# EAGLE schematic HeadphoneSlice (EAGLE 7.5.0)
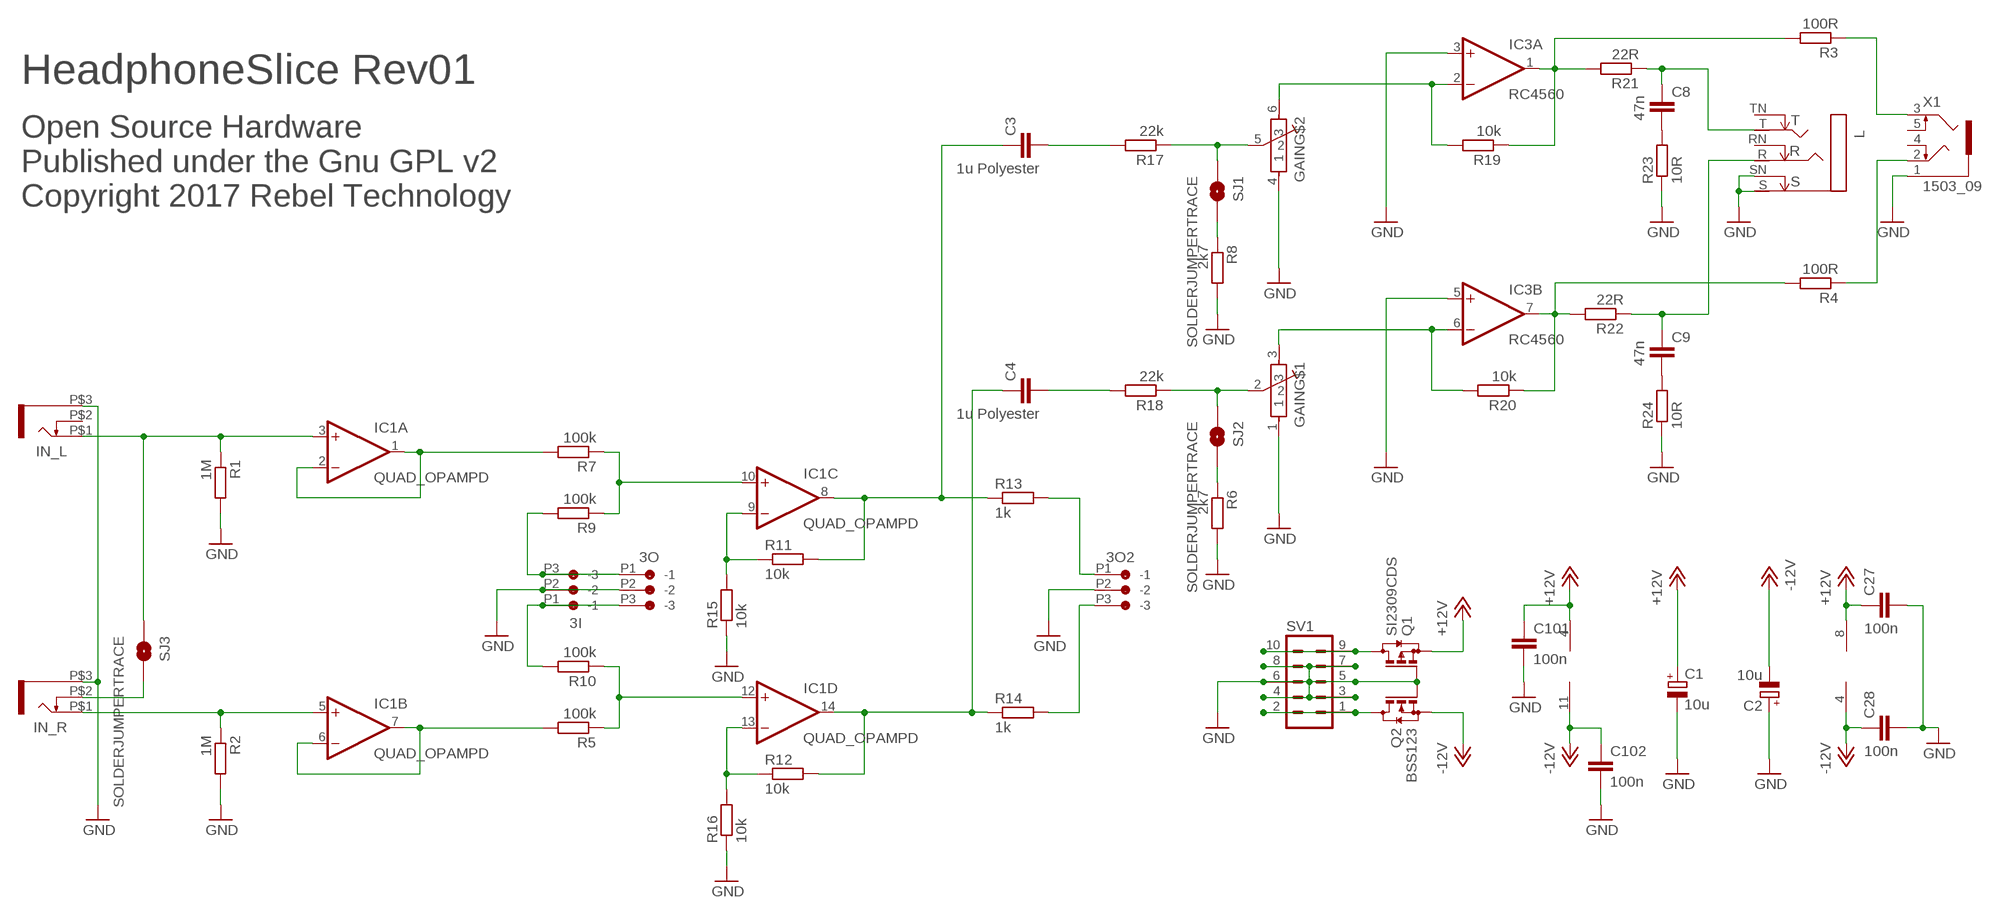
[diagram p0: schematic, sheet 1]

## Parts
3I  CON-JST_PH_3W  [CON-JST_PH_3W]
3O  CON-JST_PH_3W  [CON-JST_PH_3W]
3O2  CON-JST_PH_3W  [CON-JST_PH_3W]
C1  10u  CPOL-EU153CLV-0505  [153CLV-0505]
C2  10u  CPOL-EU153CLV-0505  [153CLV-0505]
C3  1u Polyester  C-EUC1210  [C1210]
C4  1u Polyester  C-EUC1210  [C1210]
C8  47n  C-EUC0603  [C0603]
C9  47n  C-EUC0603  [C0603]
C27  100n  C-EUC0603  [C0603]
C28  100n  C-EUC0603  [C0603]
C101  100n  C-EUC0603  [C0603]
C102  100n  C-EUC0603  [C0603]
GAIN  POT-BOURNS-PTD902  [POT-BOURNS-PTD902]
IC1  QUAD_OPAMPD  [SO14]
IC3  RC4560  NE5532D  [SO08]
IN_L  JACK-UJ-3502-RSLOT  [UJ-3502-R-SLOT]
IN_R  JACK-UJ-3502-RSLOT  [UJ-3502-R-SLOT]
L  NEUTRIK_NMJ6HCD2  [NMJ6HCD2]
Q1  SI2309CDS  BSS84  [SOT23]
Q2  BSS123  [SOT23]
R1  1M  R-EU_0603  [0603]
R2  1M  R-EU_0603  [0603]
R3  100R  R-EU_0603  [0603]
R4  100R  R-EU_0603  [0603]
R5  100k  R-EU_0603  [0603]
R6  2k7  R-EU_0603  [0603]
R7  100k  R-EU_0603  [0603]
R8  2k7  R-EU_0603  [0603]
R9  100k  R-EU_0603  [0603]
R10  100k  R-EU_0603  [0603]
R11  10k  R-EU_0603  [0603]
R12  10k  R-EU_0603  [0603]
R13  1k  R-EU_0603  [0603]
R14  1k  R-EU_0603  [0603]
R15  10k  R-EU_0603  [0603]
R16  10k  R-EU_0603  [0603]
R17  22k  R-EU_0603  [0603]
R18  22k  R-EU_0603  [0603]
R19  10k  R-EU_0603  [0603]
R20  10k  R-EU_0603  [0603]
R21  22R  R-EU_0603  [0603]
R22  22R  R-EU_0603  [0603]
R23  10R  R-EU_0603  [0603]
R24  10R  R-EU_0603  [0603]
SJ1  SOLDERJUMPERTRACE  [SJ_2S-TRACE]
SJ2  SOLDERJUMPERTRACE  [SJ_2S-TRACE]
SJ3  SOLDERJUMPERTRACE  [SJ_2S-TRACE]
SV1  MA05-2  [MA05-2]
X1  1503_09  [1503_09]

## Nets
+12V: C1.+ C27.1 C101.1 IC1.4(P:V+) IC3.8(P:V+) Q1.2(S)
-12V: C2.- C28.1 C102.1 IC1.11(P:V-) IC3.4(P:V-) Q2.2(S)
BUS_IN_L: 3I.P3(-3) 3O.P1(-1) R9.2
BUS_IN_R: 3I.P1(-1) 3O.P3(-3) R10.2
BUS_OUT_L: 3O2.P1(-1) R13.2
BUS_OUT_R: 3O2.P3(-3) R14.2
GND: 3I.P2(-2) 3O2.P2(-2) 3O.P2(-2) C1.- C2.+ C27.2 C28.2 C101.2 C102.2 GAIN.1 GAIN.4 IC3.3(A:+IN) IC3.5(B:+IN) IN_L.P$3(SLEEVE) IN_R.P$3(SLEEVE) L.S L.SN Q1.1(G) Q2.1(G) R1.2 R2.2 R6.2 R8.2 R15.1 R16.1 R23.1 R24.1 SV1.3 SV1.4 SV1.5 SV1.6 SV1.7 SV1.8 X1.1
HP_L: C8.1 L.T R21.1
HP_R: C9.1 L.R R22.1
IN_B1: IN_R.P$2(SW) SJ3.2
IN_L: IC1.3(A:+IN) IN_L.P$1(TIP) R1.1 SJ3.1
IN_R: IC1.5(B:+IN) IN_R.P$1(TIP) R2.1
LINE_L: R3.1 X1.3
LINE_R: R4.1 X1.2
N$1: Q2.3(D) SV1.1 SV1.2
N$2: IC3.7(B:OUT) R4.2 R20.1 R22.2
N$3: GAIN.6 IC3.2(A:-IN) R19.2
N$4: C4.2 R18.2
N$5: GAIN.5 R17.1 SJ1.1
N$6: GAIN.2 R18.1 SJ2.1
N$7: C4.1 IC1.14(D:OUT) R12.2 R14.1
N$8: C3.2 R17.2
N$9: R8.1 SJ1.2
N$10: C3.1 IC1.8(C:OUT) R11.2 R13.1
N$11: IC1.6(B:-IN) IC1.7(B:OUT) R5.2
N$12: C9.2 R24.2
N$13: IC1.1(A:OUT) IC1.2(A:-IN) R7.2
N$14: Q1.3(D) SV1.9 SV1.10
N$15: R6.1 SJ2.2
N$16: GAIN.3 IC3.6(B:-IN) R20.2
N$17: IC1.9(C:-IN) R11.1 R15.2
N$18: IC1.13(D:-IN) R12.1 R16.2
N$19: IC3.1(A:OUT) R3.2 R19.1 R21.2
N$21: C8.2 R23.2
N$45: IC1.12(D:+IN) R5.1 R10.1
N$50: IC1.10(C:+IN) R7.1 R9.1
Unconnected: IN_L.P$2(SW) L.RN L.TN X1.4 X1.5

## Notes on the sheet
- HeadphoneSlice Rev01
- Open Source Hardware
  Published under the Gnu GPL v2
  Copyright 2017 Rebel Technology

## Library data of the parts
3I 3O 3O2 = Rebel:CON-JST_PH_3W
C1 C2 = rcl:CPOL-EU: POLARIZED CAPACITOR, European symbol
C3 C4 C8 C9 C27 C28 C101 C102 = Rebel:C-EU: CAPACITOR, European symbol
GAIN = Rebel:POT-BOURNS-PTD902
IC1 = adafruit:QUAD_OPAMP: OP AMP Standard quad package
IC3 = linear:NE5532: AUDIO AMPLIFIER
IN_L IN_R = Rebel:JACK-UJ-3502-R
L = neutrik_jacks:NEUTRIK_NMJ6HCD2
Q1 = transistor-small-signal:BSS84: P-CHANNEL MOS FET
Q2 = transistor-small-signal:BSS123: N-CHANNEL MOS FET
R1-R24 = Rebel:R-EU_: RESISTOR, European symbol
SJ1-SJ3 = SparkFun:SOLDERJUMPER: Solder Jumper Standard SMD solder jumper. Used to automate production. Two varients : Normally Open and Normally Closed are the same, but have different paste layers. NC will have a large amount of paste and should jumper during reflow.
SV1 = con-lstb:MA05-2: PIN HEADER; OC_FARNELL: unknown; OC_NEWARK: unknown
X1 = con-lumberg:1503_09: Jack connectors according to JISC 6560, 3.5 mm Klinkeneinbaukupplung nach JISC 6560, 3,5 mm, 3-polig/ stereo, abgewinkelte Ausführung, mit 2 Öffnern und Lötaugen, für Leiterplatten Rückseitenmontage Source: http://www.lumberg.com/Produkte/PDFs/1503_09.pdf; OC_FARNELL: 1243244; OC_NEWARK: unknown